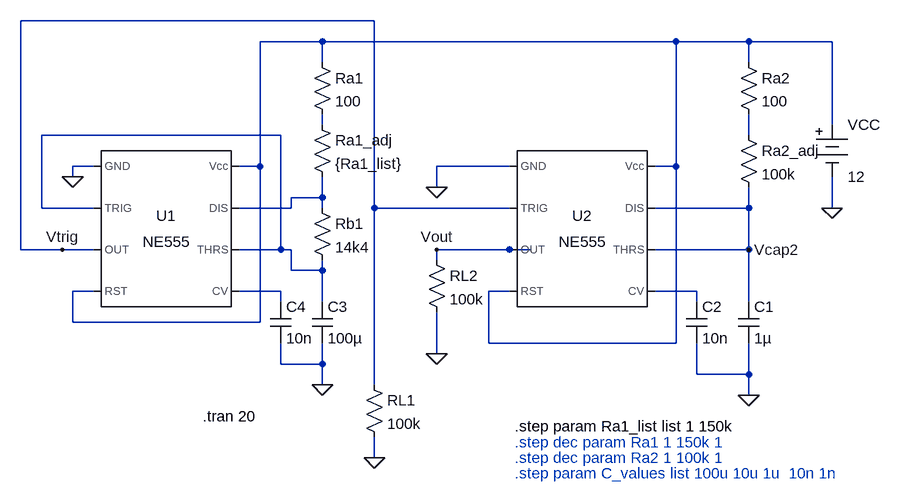
[diagram p0: schematic 3_12_pablo_gomez_tp9_ej1.asc]
3_12_pablo_gomez_tp9_ej1.asc, the LTspice schematic file:
Version 4
SHEET 1 880 680
WIRE -192 -176 -736 -176
WIRE -272 -144 -368 -144
WIRE 272 -144 -272 -144
WIRE 384 -144 272 -144
WIRE 512 -144 384 -144
WIRE -272 -112 -272 -144
WIRE 384 -112 384 -144
WIRE -272 -16 -272 -32
WIRE 512 -16 512 -144
WIRE -336 0 -704 0
WIRE 384 0 384 -32
WIRE -624 48 -656 48
WIRE -368 48 -368 -144
WIRE -368 48 -400 48
WIRE 16 48 -96 48
WIRE 272 48 272 -144
WIRE 272 48 240 48
WIRE -656 64 -656 48
WIRE -96 80 -96 48
WIRE -272 96 -272 64
WIRE -272 96 -320 96
WIRE -704 112 -704 0
WIRE -624 112 -704 112
WIRE -320 112 -320 96
WIRE -320 112 -400 112
WIRE -272 112 -272 96
WIRE -192 112 -192 -176
WIRE 16 112 -192 112
WIRE 384 112 384 80
WIRE 384 112 240 112
WIRE 512 112 512 64
WIRE -736 176 -736 -176
WIRE -672 176 -736 176
WIRE -624 176 -672 176
WIRE -336 176 -336 0
WIRE -336 176 -400 176
WIRE -320 176 -336 176
WIRE 16 176 -96 176
WIRE 48 176 16 176
WIRE 384 176 384 112
WIRE 384 176 240 176
WIRE -96 192 -96 176
WIRE -320 208 -320 176
WIRE -272 208 -272 192
WIRE -272 208 -320 208
WIRE -624 240 -656 240
WIRE -336 240 -400 240
WIRE 16 240 -16 240
WIRE 304 240 240 240
WIRE -336 256 -336 240
WIRE -272 256 -272 208
WIRE 304 256 304 240
WIRE 384 256 384 176
WIRE -656 288 -656 240
WIRE -368 288 -368 48
WIRE -368 288 -656 288
WIRE -16 320 -16 240
WIRE 272 320 272 48
WIRE 272 320 -16 320
WIRE -96 336 -96 272
WIRE -336 352 -336 320
WIRE -272 352 -272 320
WIRE -272 352 -336 352
WIRE 304 368 304 320
WIRE 384 368 384 320
WIRE 384 368 304 368
WIRE -272 384 -272 352
WIRE -192 384 -192 112
WIRE 384 400 384 368
WIRE -192 496 -192 464
FLAG 512 112 0
FLAG 384 400 0
FLAG -96 80 0
FLAG -96 336 0
FLAG -96 176 Vout
FLAG -656 64 0
FLAG -272 384 0
FLAG -672 176 Vtrig
FLAG 384 176 Vcap2
FLAG -192 496 0
SYMBOL Misc\\NE555 -512 144 R0
SYMATTR InstName U1
SYMBOL Misc\\battery 512 -32 R0
WINDOW 123 0 0 Left 0
WINDOW 39 0 0 Left 0
SYMATTR InstName VCC
SYMATTR Value 12
SYMBOL res 368 -16 R0
SYMATTR InstName Ra2_adj
SYMATTR Value 100k
SYMBOL cap 368 256 R0
SYMATTR InstName C1
SYMATTR Value 1µ
SYMBOL res -112 176 R0
SYMATTR InstName RL2
SYMATTR Value 100k
SYMBOL cap 288 256 R0
SYMATTR InstName C2
SYMATTR Value 10n
SYMBOL Misc\\NE555 128 144 R0
SYMATTR InstName U2
SYMBOL res -288 -128 R0
SYMATTR InstName Ra1
SYMATTR Value 100
SYMBOL res -288 96 R0
SYMATTR InstName Rb1
SYMATTR Value 14k4
SYMBOL cap -288 256 R0
SYMATTR InstName C3
SYMATTR Value 100µ
SYMBOL cap -352 256 R0
SYMATTR InstName C4
SYMATTR Value 10n
SYMBOL res -208 368 R0
SYMATTR InstName RL1
SYMATTR Value 100k
SYMBOL res -288 -32 R0
SYMATTR InstName Ra1_adj
SYMATTR Value {Ra1_list}
SYMBOL res 368 -128 R0
SYMATTR InstName Ra2
SYMATTR Value 100
TEXT -456 432 Left 2 !.tran 20
TEXT 24 472 Left 2 ;.step dec param Ra1 1 150k 1
TEXT 24 520 Left 2 ;.step param C_values list 100u 10u 1u  10n 1n
TEXT 24 496 Left 2 ;.step dec param Ra2 1 100k 1
TEXT 24 448 Left 2 !.step param Ra1_list list 1 150k

The netlist it stands for:
* 3_12_pablo_gomez_tp9_ej1.asc
XU1 0 N003 Vtrig N001 N006 N003 N005 N001 NE555  ; pins GND TRIG OUT RST CV THRS DIS Vcc
VCC N001 0 12
Ra2_adj N004 Vcap2 100k
C1 Vcap2 0 1µ
RL2 Vout 0 100k
C2 N007 0 10n
XU2 0 Vtrig Vout N001 N007 Vcap2 Vcap2 N001 NE555  ; pins GND TRIG OUT RST CV THRS DIS Vcc
Ra1 N001 N002 100
Rb1 N005 N003 14k4
C3 N003 0 100µ
C4 N006 0 10n
RL1 Vtrig 0 100k
Ra1_adj N002 N005 {Ra1_list}
Ra2 N001 N004 100
.tran 20
* .step dec param Ra1 1 150k 1
* .step param C_values list 100u 10u 1u  10n 1n
* .step dec param Ra2 1 100k 1
.step param Ra1_list list 1 150k
.lib NE555.sub
.backanno
.end